# EasyEDA schematic 1-Schematic_GPIO_WAVER.json
TITLE: Sheet_1; REV: 1.0; Date: 2022-12-25; Sheet: 1/1; Drawn By: maarnotto; Company: Your Company
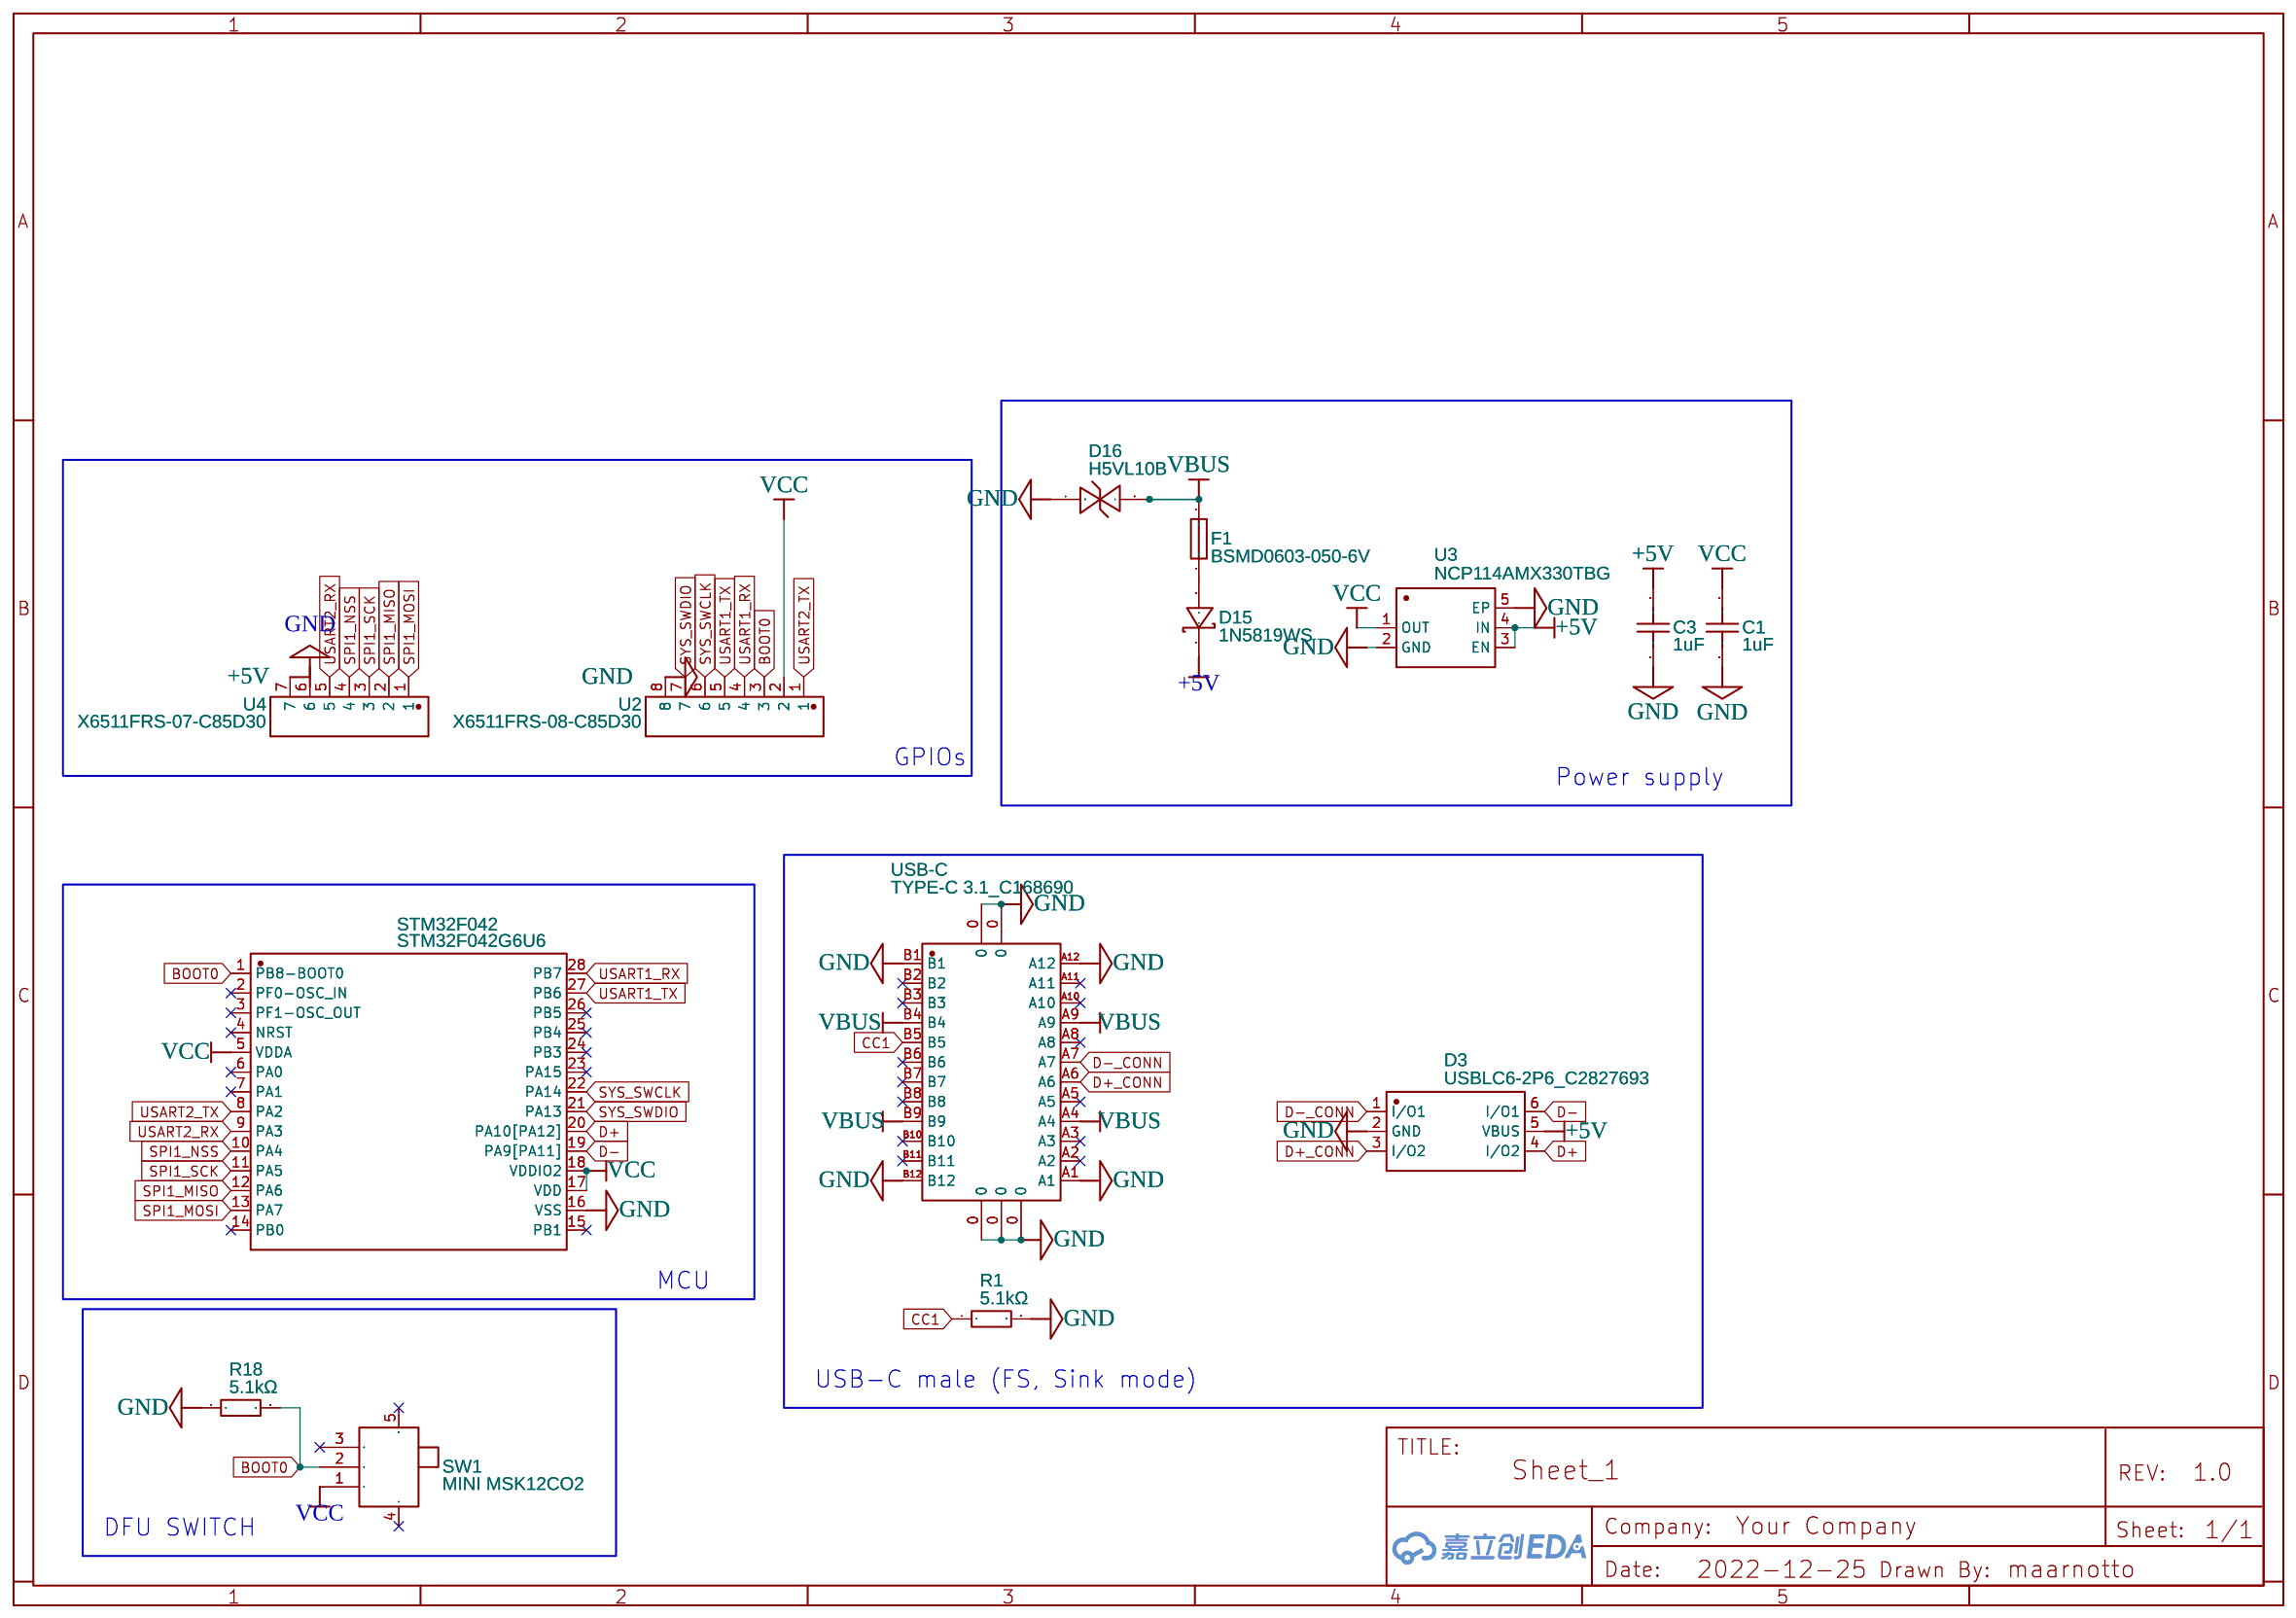
[diagram p0: schematic sheet]

## Parts
C1  1uF  [C0402]
C3  1uF  [C0402]
D3  USBLC6-2P6_C2827693  [SOT-666-6_L1.6-W1.2-P0.50-LS1.6-BL]
D15  1N5819WS  [SOD-323_L1.8-W1.3-LS2.5-RD]
D16  H5VL10B  [SOD-882_L1.0-W0.6-BI]
F1  BSMD0603-050-6V  [F0603]
R1  5.1kΩ  [R0402]
R18  5.1kΩ  [R0402]
STM32F042  STM32F042G6U6  [UFQFPN-28_L4.0-W4.0-P0.50-BL]
SW1  MINI MSK12CO2  [SW-SMD_MSK12CO2]
U2  X6511FRS-08-C85D30  [HDR-SMD_8P-P2.54-H-F-L11.5]
U3  NCP114AMX330TBG  [UDFN-4_L1.0-W1.0-P0.65-BL-EP]
U4  X6511FRS-07-C85D30  [HDR-SMD_7P-P2.54-H-F-L11.5]
USB-C  TYPE-C 3.1_C168690  [USB-C-SMD_TYPE-C-USB-3]

## Library data of the parts
C1 C3 = C_0603_US: Contributor: LCEDA_Lib
D3 = USBLC6-2P6_C2827693: Contributor: LCSC; Supplier: LCSC; Supplier Part: C2827693; Manufacturer: TECH PUBLIC(台舟); Manufacturer Part: USBLC6-2P6; JLCPCB Part Class: Extended Part
D15 = 1N5819WS: Contributor: LCSC; Supplier: LCSC; Supplier Part: C191023; Manufacturer: Hottech(合科泰); JLCPCB Part Class: Basic Part
D16 = H5VL10B: Supplier: LCSC; Supplier Part: C7420372; Manufacturer: 宏迦橙; Contributor: lcsc; JLCPCB Part Class: Extended Part
F1 = BSMD0603-050-6V: Contributor: LCSC; Supplier: LCSC; Supplier Part: C883095; Manufacturer: BHFUSE(佰宏); JLCPCB Part Class: Extended Part
R1 R18 = 0402WGF5101TCE: Supplier: LCSC; Manufacturer: UNI-ROYAL(厚声); Supplier Part: C25905; JLCPCB Part Class: Basic Part
STM32F042 = STM32F042G6U6: Contributor: LCSC; Supplier: LCSC; Supplier Part: C961597; Manufacturer: ST(意法半导体); JLCPCB Part Class: Extended Part
SW1 = MINI MSK12CO2: Contributor: LCSC; Supplier: LCSC; Supplier Part: C2681570; Manufacturer: SHOU HAN(首韩); JLCPCB Part Class: Extended Part
U2 = X6511FRS-08-C85D30: Contributor: lcsc; Supplier: LCSC; Supplier Part: C5142241; Manufacturer: XKB Connectivity(中国星坤); JLCPCB Part Class: Extended Part
U3 = NCP114AMX330TBG: Contributor: LCSC; Supplier: LCSC; Supplier Part: C603494; Manufacturer: onsemi(安森美); JLCPCB Part Class: Extended Part
U4 = X6511FRS-07-C85D30: Contributor: lcsc; Supplier: LCSC; Supplier Part: C5142240; Manufacturer: XKB Connectivity(中国星坤); JLCPCB Part Class: Extended Part
USB-C = TYPE-C 3.1_C168690: Contributor: 立创EDA官方封装库; Supplier: LCSC; Supplier Part: C168690; Manufacturer: 精拓金; Manufacturer Part: 918-118A2021Y40000; JLCPCB Part Class: Extended Part

## Nets
+5V: C3.2 D3.5(VBUS) D15.1(K) U3.3(EN) U3.4(IN) U4.7
GND: C1.1 C3.1 D3.2(GND) D16.1(C) R1.2 R18.1 STM32F042.16(VSS) U2.8 U3.2(GND) U3.5(EP) U4.6 USB-C.0 USB-C.A1 USB-C.A12 USB-C.B1 USB-C.B12
VBUS: D16.2(A) F1.2 USB-C.A4 USB-C.A9 USB-C.B4 USB-C.B9
VCC: C1.2 STM32F042.5(VDDA) STM32F042.17(VDD) STM32F042.18(VDDIO2) SW1.1 U2.2 U3.1(OUT)
BOOT0: R18.2 STM32F042.1(PB8-BOOT0) SW1.2 U2.3
CC1: R1.1 USB-C.B5
D+: D3.4(I/O2) STM32F042.20(PA10[PA12])
D+_CONN: D3.3(I/O2) USB-C.A6
D-: D3.6(I/O1) STM32F042.19(PA9[PA11])
D-_CONN: D3.1(I/O1) USB-C.A7
SPI1_MISO: STM32F042.12(PA6) U4.2
SPI1_MOSI: STM32F042.13(PA7) U4.1
SPI1_NSS: STM32F042.10(PA4) U4.4
SPI1_SCK: STM32F042.11(PA5) U4.3
SYS_SWCLK: STM32F042.22(PA14) U2.6
SYS_SWDIO: STM32F042.21(PA13) U2.7
USART1_RX: STM32F042.28(PB7) U2.4
USART1_TX: STM32F042.27(PB6) U2.5
USART2_RX: STM32F042.9(PA3) U4.5
USART2_TX: STM32F042.8(PA2) U2.1
Net-(D15-2): D15.2(A) F1.1

Not connected (* = marked no-connect by the designer): STM32F042 2(PF0-OSC_IN)* 3(PF1-OSC_OUT)* 4(NRST)* 6(PA0)* 7(PA1)* 14(PB0)* 15(PB1)* 23(PA15)* 24(PB3)* 25(PB4)* 26(PB5)*; SW1 3* 4* 5*; USB-C A2* A3* A5* A8* A10* A11* B2* B3* B6* B7* B8* B10* B11*

## Notes on the sheet
- GPIOs
- Power supply
- MCU
- USB-C male (FS, Sink mode)
- DFU SWITCH
